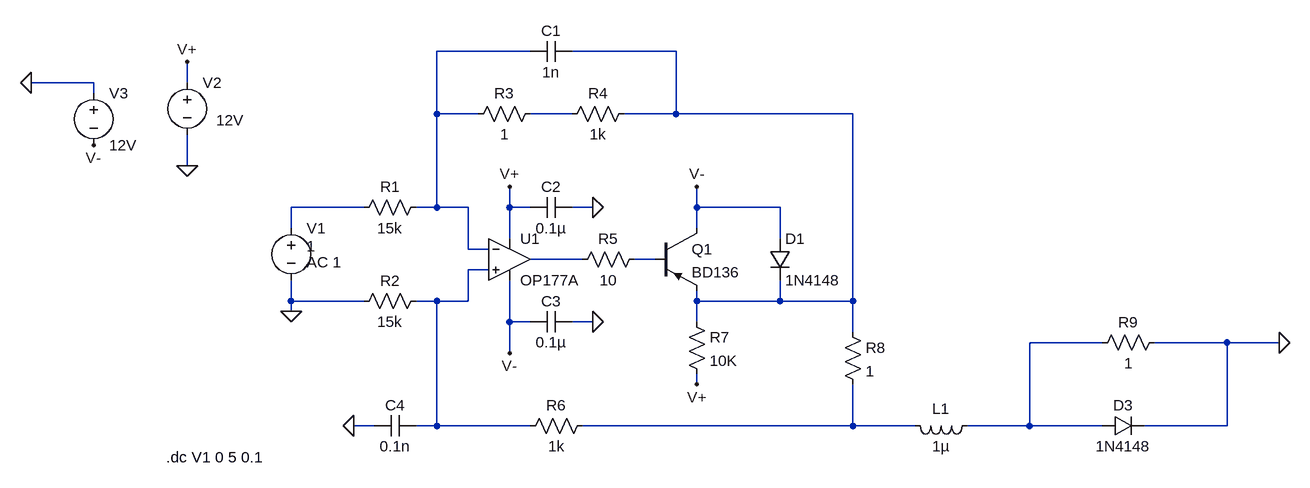
[diagram p0: schematic Fuente de corriente.asc]
Fuente de corriente.asc, the LTspice schematic file:
Version 4
SHEET 1 1812 680
WIRE 320 -144 176 -144
WIRE 544 -144 384 -144
WIRE -352 -96 -448 -96
WIRE -208 -96 -208 -128
WIRE -352 -80 -352 -96
WIRE 176 -48 176 -144
WIRE 240 -48 176 -48
WIRE 384 -48 320 -48
WIRE 544 -48 544 -144
WIRE 544 -48 464 -48
WIRE 816 -48 544 -48
WIRE -208 32 -208 -16
WIRE 64 96 -48 96
WIRE 176 96 176 -48
WIRE 176 96 144 96
WIRE 224 96 176 96
WIRE 288 96 288 64
WIRE 320 96 288 96
WIRE 416 96 384 96
WIRE 576 96 576 64
WIRE 704 96 576 96
WIRE -48 128 -48 96
WIRE 576 128 576 96
WIRE 288 144 288 96
WIRE 704 144 704 96
WIRE 224 160 224 96
WIRE 256 160 224 160
WIRE 400 176 320 176
WIRE 512 176 480 176
WIRE 256 192 224 192
WIRE -48 240 -48 208
WIRE 64 240 -48 240
WIRE 176 240 144 240
WIRE 224 240 224 192
WIRE 224 240 176 240
WIRE 576 240 576 224
WIRE 704 240 704 208
WIRE 704 240 576 240
WIRE 816 240 816 -48
WIRE 816 240 704 240
WIRE -48 256 -48 240
WIRE 288 272 288 208
WIRE 320 272 288 272
WIRE 416 272 384 272
WIRE 576 272 576 240
WIRE 816 288 816 240
WIRE 1200 304 1088 304
WIRE 1392 304 1280 304
WIRE 1472 304 1392 304
WIRE 288 320 288 272
WIRE 576 368 576 352
WIRE 80 432 48 432
WIRE 176 432 176 240
WIRE 176 432 144 432
WIRE 320 432 176 432
WIRE 816 432 816 368
WIRE 816 432 400 432
WIRE 912 432 816 432
WIRE 1088 432 1088 304
WIRE 1088 432 992 432
WIRE 1200 432 1088 432
WIRE 1392 432 1392 304
WIRE 1392 432 1264 432
FLAG -48 256 0
FLAG 416 96 0
FLAG 288 64 V+
FLAG -208 -128 V+
FLAG -352 0 V-
FLAG 416 272 0
FLAG 288 320 V-
FLAG 48 432 0
FLAG 576 64 V-
FLAG 576 368 V+
FLAG 1472 304 0
FLAG -208 32 0
FLAG -448 -96 0
SYMBOL res 160 80 R90
WINDOW 0 0 56 VBottom 2
WINDOW 3 32 56 VTop 2
SYMATTR InstName R1
SYMATTR Value 15k
SYMBOL res 160 224 R90
WINDOW 0 0 56 VBottom 2
WINDOW 3 32 56 VTop 2
SYMATTR InstName R2
SYMATTR Value 15k
SYMBOL voltage -48 112 R0
WINDOW 123 24 68 Left 2
WINDOW 39 0 0 Left 0
WINDOW 3 24 44 Left 2
SYMATTR Value2 AC 1
SYMATTR InstName V1
SYMATTR Value 1
SYMBOL OpAmps\\OP177A 288 112 R0
SYMATTR InstName U1
SYMBOL res 336 -64 R90
WINDOW 0 0 56 VBottom 2
WINDOW 3 32 56 VTop 2
SYMATTR InstName R3
SYMATTR Value 1
SYMBOL res 480 -64 R90
WINDOW 0 0 56 VBottom 2
WINDOW 3 32 56 VTop 2
SYMATTR InstName R4
SYMATTR Value 1k
SYMBOL cap 384 -160 R90
WINDOW 0 0 32 VBottom 2
WINDOW 3 32 32 VTop 2
SYMATTR InstName C1
SYMATTR Value 1n
SYMBOL cap 384 80 R90
WINDOW 0 0 32 VBottom 2
WINDOW 3 32 32 VTop 2
SYMATTR InstName C2
SYMATTR Value 0.1µ
SYMBOL voltage -208 -112 R0
WINDOW 123 0 0 Left 0
WINDOW 39 0 0 Left 0
WINDOW 3 45 74 Left 2
SYMATTR Value 12V
SYMATTR InstName V2
SYMBOL cap 384 256 R90
WINDOW 0 0 32 VBottom 2
WINDOW 3 32 32 VTop 2
SYMATTR InstName C3
SYMATTR Value 0.1µ
SYMBOL res 496 160 R90
WINDOW 0 0 56 VBottom 2
WINDOW 3 32 56 VTop 2
SYMATTR InstName R5
SYMATTR Value 10
SYMBOL cap 144 416 R90
WINDOW 0 0 32 VBottom 2
WINDOW 3 32 32 VTop 2
SYMATTR InstName C4
SYMATTR Value 0.1n
SYMBOL res 416 416 R90
WINDOW 0 0 56 VBottom 2
WINDOW 3 32 56 VTop 2
SYMATTR InstName R6
SYMATTR Value 1k
SYMBOL res 560 256 R0
SYMATTR InstName R7
SYMATTR Value 10K
SYMBOL diode 688 144 R0
SYMATTR InstName D1
SYMATTR Value 1N4148
SYMBOL res 800 272 R0
SYMATTR InstName R8
SYMATTR Value 1
SYMBOL ind 1008 416 R90
WINDOW 0 5 56 VBottom 2
WINDOW 3 32 56 VTop 2
SYMATTR InstName L1
SYMATTR Value 1µ
SYMBOL res 1184 320 R270
WINDOW 0 32 56 VTop 2
WINDOW 3 0 56 VBottom 2
SYMATTR InstName R9
SYMATTR Value 1
SYMBOL diode 1200 448 R270
WINDOW 0 32 32 VTop 2
WINDOW 3 0 32 VBottom 2
SYMATTR InstName D3
SYMATTR Value 1N4148
SYMBOL voltage -352 -96 R0
WINDOW 123 0 0 Left 0
WINDOW 39 0 0 Left 0
SYMATTR InstName V3
SYMATTR Value 12V
SYMBOL pnp 512 128 R0
SYMATTR InstName Q1
SYMATTR Value BD136
TEXT -240 480 Left 2 !.dc V1 0 5 0.1

The netlist it stands for:
* Fuente de corriente.asc
R1 N001 N004 15k
R2 N007 0 15k
V1 N004 0 1 AC 1
XU1 N007 N001 V+ V- N005 OP177A  ; pins In+ In- V+ V- OUT
R3 N003 N001 1
R4 N002 N003 1k
C1 N002 N001 1n
C2 0 V+ 0.1µ
V2 V+ 0 12V
C3 0 V- 0.1µ
R5 N006 N005 10
C4 N007 0 0.1n
R6 N009 N007 1k
R7 N002 V+ 10K
D1 V- N002 1N4148
R8 N002 N009 1
L1 N008 N009 1µ
R9 N008 0 1
D3 N008 0 1N4148
V3 0 V- 12V
Q1 V- N006 N002 0 BD136
.model D D
.lib standard.dio
.model NPN NPN
.model PNP PNP
.lib standard.bjt
.dc V1 0 5 0.1
.backanno
.end